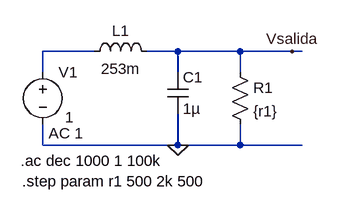
[diagram p0: schematic Punto 2.asc]
Punto 2.asc, the LTspice schematic file:
Version 4
SHEET 1 880 680
WIRE 64 96 -16 96
WIRE 192 96 144 96
WIRE 288 96 192 96
WIRE 368 96 288 96
WIRE 384 96 368 96
WIRE -16 128 -16 96
WIRE 192 128 192 96
WIRE 288 128 288 96
WIRE -16 240 -16 208
WIRE 192 240 192 192
WIRE 192 240 -16 240
WIRE 288 240 288 208
WIRE 288 240 192 240
WIRE 384 240 288 240
FLAG 192 240 0
FLAG 368 96 Vsalida
SYMBOL voltage -16 112 R0
WINDOW 3 34 85 Left 2
WINDOW 123 9 110 Left 2
WINDOW 39 0 0 Left 0
SYMATTR InstName V1
SYMATTR Value 1
SYMATTR Value2 AC 1
SYMBOL ind 48 112 R270
WINDOW 0 32 56 VTop 2
WINDOW 3 5 56 VBottom 2
SYMATTR InstName L1
SYMATTR Value 253m
SYMBOL cap 176 128 R0
SYMATTR InstName C1
SYMATTR Value 1µ
SYMBOL res 272 112 R0
SYMATTR InstName R1
SYMATTR Value {r1}
TEXT -50 264 Left 2 !.ac dec 1000 1 100k
TEXT -48 296 Left 2 !.step param r1 500 2k 500

The netlist it stands for:
* Punto 2.asc
V1 N001 0 1 AC 1
L1 N001 Vsalida 253m
C1 Vsalida 0 1µ
R1 Vsalida 0 {r1}
.ac dec 1000 1 100k
.step param r1 500 2k 500
.backanno
.end

* Results of the author's LTspice run, read from the files saved beside the schematic
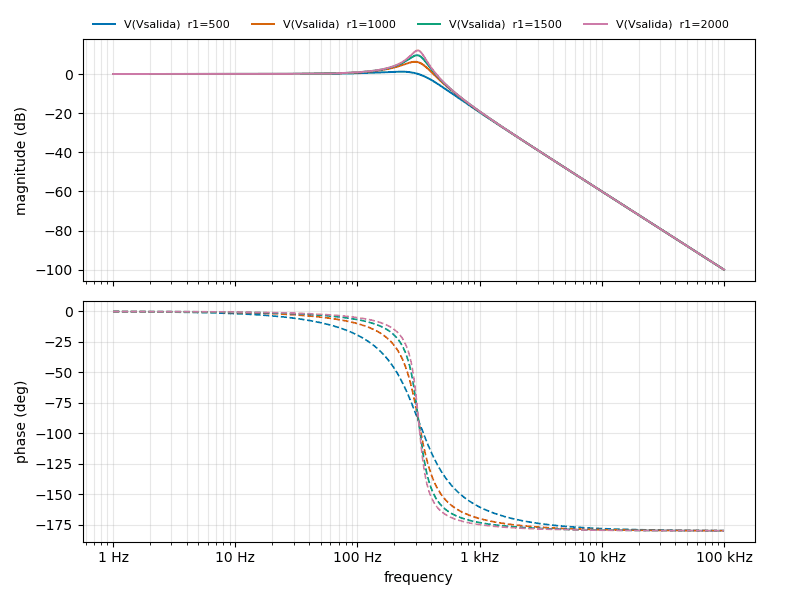
[diagram p1: AC Analysis of Punto 2.asc, plotted from the saved traces]
* AC Analysis, 4 runs:
*   V(Vsalida) [r1=500]: 0.00 dB at 1 Hz, -99.99 dB at 100 kHz, peak 1.21 dB at 222.3 Hz, 3 dB below the peak at 369.5 Hz
*   V(Vsalida) [r1=1000]: 0.00 dB at 1 Hz, -99.99 dB at 100 kHz, peak 6.25 dB at 295.8 Hz, 3 dB below the peak at 196.8 Hz and 369 Hz
*   V(Vsalida) [r1=1500]: 0.00 dB at 1 Hz, -99.99 dB at 100 kHz, peak 9.61 dB at 307.6 Hz, 3 dB below the peak at 247.8 Hz and 357.2 Hz
*   V(Vsalida) [r1=2000]: 0.00 dB at 1 Hz, -99.99 dB at 100 kHz, peak 12.06 dB at 311.2 Hz, 3 dB below the peak at 268.3 Hz and 349.2 Hz